# Altium schematic sheet Power Supplies.SchDoc
size A2; SheetNumber: 2; SheetTotal: 16
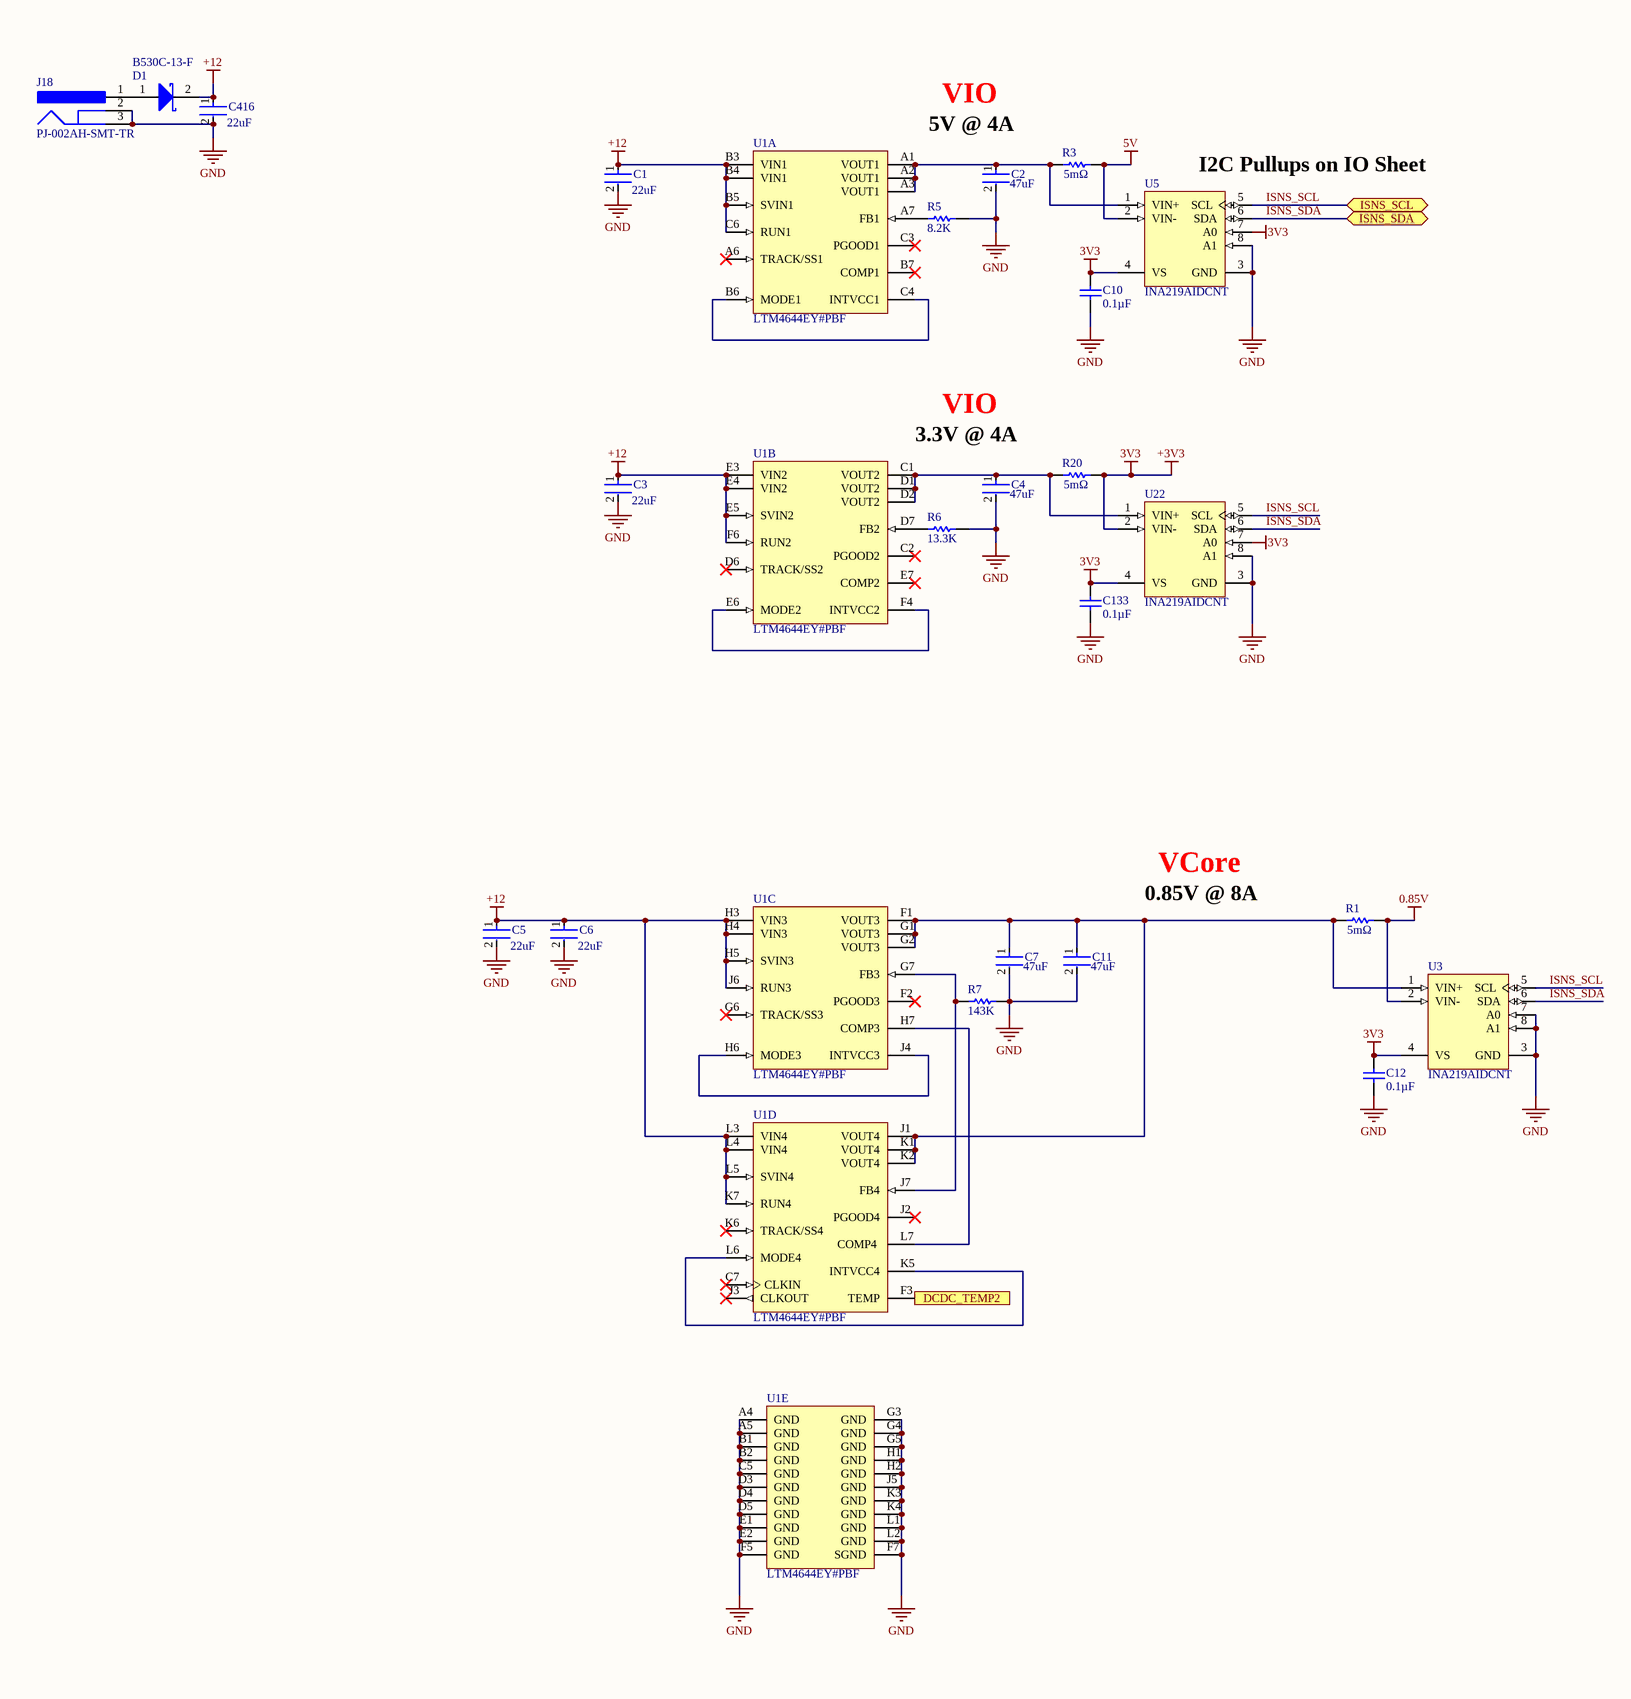
[diagram p0: Power Supplies.SchDoc, left]
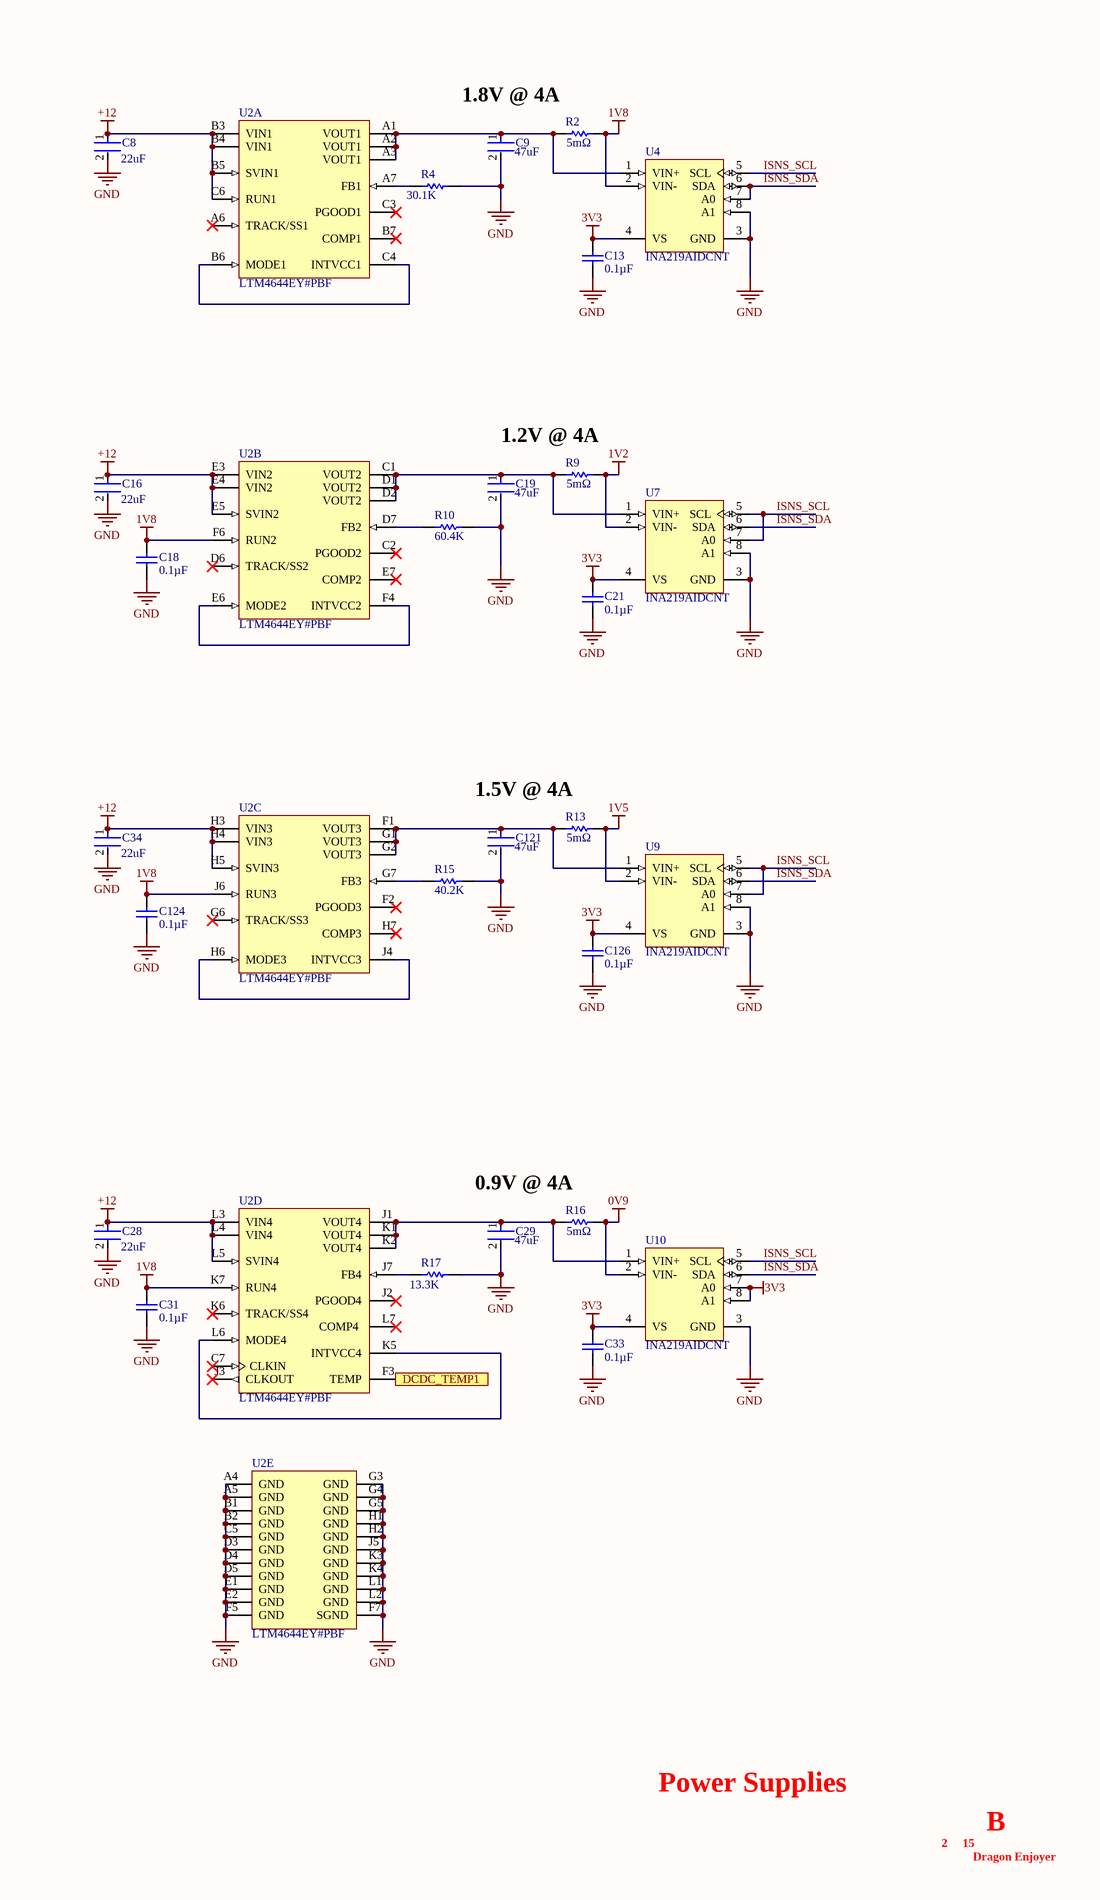
[diagram p1: Power Supplies.SchDoc, right]

## Parts
C1  value 22uF  [FP-CL31H-0_2-MFG]  (hidden comment: CL31A226KAHNNNE)
C2  Capacitance: 47uF  [FP-GRM31C-0_2-e0_3_0_8-IPC_C]  (hidden comment: GRM31CR60J476ME19L)
C3  value 22uF  [FP-CL31H-0_2-MFG]  (hidden comment: CL31A226KAHNNNE)
C4  Capacitance: 47uF  [FP-GRM31C-0_2-e0_3_0_8-IPC_C]  (hidden comment: GRM31CR60J476ME19L)
C5  value 22uF  [FP-CL31H-0_2-MFG]  (hidden comment: CL31A226KAHNNNE)
C6  value 22uF  [FP-CL31H-0_2-MFG]  (hidden comment: CL31A226KAHNNNE)
C7  Capacitance: 47uF  [FP-GRM31C-0_2-e0_3_0_8-IPC_C]  (hidden comment: GRM31CR60J476ME19L)
C8  value 22uF  [FP-CL31H-0_2-MFG]  (hidden comment: CL31A226KAHNNNE)
C9  Capacitance: 47uF  [FP-GRM31C-0_2-e0_3_0_8-IPC_C]  (hidden comment: GRM31CR60J476ME19L)
C10  Capacitance: 0.1µF  [CAPC1005X55X25LL05T05]  (hidden comment: CC0402ZRY5V8BB104)
C11  Capacitance: 47uF  [FP-GRM31C-0_2-e0_3_0_8-IPC_C]  (hidden comment: GRM31CR60J476ME19L)
C12  Capacitance: 0.1µF  [CAPC1005X55X25LL05T05]  (hidden comment: CC0402ZRY5V8BB104)
C13  Capacitance: 0.1µF  [CAPC1005X55X25LL05T05]  (hidden comment: CC0402ZRY5V8BB104)
C16  value 22uF  [FP-CL31H-0_2-MFG]  (hidden comment: CL31A226KAHNNNE)
C18  Capacitance: 0.1µF  [CAPC1005X55X25LL05T05]  (hidden comment: CC0402ZRY5V8BB104)
C19  Capacitance: 47uF  [FP-GRM31C-0_2-e0_3_0_8-IPC_C]  (hidden comment: GRM31CR60J476ME19L)
C21  Capacitance: 0.1µF  [CAPC1005X55X25LL05T05]  (hidden comment: CC0402ZRY5V8BB104)
C28  value 22uF  [FP-CL31H-0_2-MFG]  (hidden comment: CL31A226KAHNNNE)
C29  Capacitance: 47uF  [FP-GRM31C-0_2-e0_3_0_8-IPC_C]  (hidden comment: GRM31CR60J476ME19L)
C31  Capacitance: 0.1µF  [CAPC1005X55X25LL05T05]  (hidden comment: CC0402ZRY5V8BB104)
C33  Capacitance: 0.1µF  [CAPC1005X55X25LL05T05]  (hidden comment: CC0402ZRY5V8BB104)
C34  value 22uF  [FP-CL31H-0_2-MFG]  (hidden comment: CL31A226KAHNNNE)
C121  Capacitance: 47uF  [FP-GRM31C-0_2-e0_3_0_8-IPC_C]  (hidden comment: GRM31CR60J476ME19L)
C124  Capacitance: 0.1µF  [CAPC1005X55X25LL05T05]  (hidden comment: CC0402ZRY5V8BB104)
C126  Capacitance: 0.1µF  [CAPC1005X55X25LL05T05]  (hidden comment: CC0402ZRY5V8BB104)
C133  Capacitance: 0.1µF  [CAPC1005X55X25LL05T05]  (hidden comment: CC0402ZRY5V8BB104)
C416  value 22uF  [FP-CL31H-0_2-MFG]  (hidden comment: CL31A226KAHNNNE)
D1  B530C-13-F  [DIOD-SMC-2_V]
J18  PJ-002AH-SMT-TR  [CUI-PJ-002AH-4_V]
R1  value 5mΩ  [RESC3216X89X64NL25T25]  (hidden comment: WSL12065L000FEA)
R2  value 5mΩ  [RESC3216X89X64NL25T25]  (hidden comment: WSL12065L000FEA)
R3  value 5mΩ  [RESC3216X89X64NL25T25]  (hidden comment: WSL12065L000FEA)
R4  value 30.1K  [RESC1609X55X30ML10T20]  (hidden comment: TNPW060330K1BEEA)
R5  8.2K  [RESC1005X40X25ML05T05]
R6  13.3K  [RESC1005X40X25NL10T10]
R7  143K  [RESC1005X40X25LL05T05]
R9  value 5mΩ  [RESC3216X89X64NL25T25]  (hidden comment: WSL12065L000FEA)
R10  value 60.4K  [RESC1608X50X30ML20T20]  (hidden comment: RG1608P-6042-B-T1)
R13  value 5mΩ  [RESC3216X89X64NL25T25]  (hidden comment: WSL12065L000FEA)
R15  40.2K  [RESC0603(1608)_M]
R16  value 5mΩ  [RESC3216X89X64NL25T25]  (hidden comment: WSL12065L000FEA)
R17  value 13.3K  [RESC1609X55X30ML10T20]  (hidden comment: TNPW060313K3BEEA)
R20  value 5mΩ  [RESC3216X89X64NL25T25]  (hidden comment: WSL12065L000FEA)
U1  LTM4644EY#PBF  [LT-BGA-77-05-08-1900_V]  (parts A,B,C,D,E of 5)
U2  LTM4644EY#PBF  [LT-BGA-77-05-08-1900_V]  (parts A,B,C,D,E of 5)
U3  INA219AIDCNT  [DCN0008A_L]
U4  INA219AIDCNT  [DCN0008A_L]
U5  INA219AIDCNT  [DCN0008A_L]
U7  INA219AIDCNT  [DCN0008A_L]
U9  INA219AIDCNT  [DCN0008A_L]
U10  INA219AIDCNT  [DCN0008A_L]
U22  INA219AIDCNT  [DCN0008A_L]

## Ports
DCDC_TEMP1 (out), DCDC_TEMP2 (out), ISNS_SCL (bidir), ISNS_SDA (bidir)

## Nets
0.85V: R1.2 U3.2(VIN-)
0V9: R16.2 U10.2(VIN-)
1V2: R9.2 U7.2(VIN-)
1V5: R13.2 U9.2(VIN-)
1V8: C18.2 C31.2 C124.2 R2.2 U2.F6(RUN2) U2.J6(RUN3) U2.K7(RUN4) U4.2(VIN-)
5V: R3.2 U5.2(VIN-)
+3V3: C10.2 C12.2 C13.2 C21.2 C33.2 C126.2 C133.2 R20.2 U3.4(VS) U4.4(VS) U5.4(VS) U5.7(A0) U7.4(VS) U9.4(VS) U10.4(VS) U10.7(A0) U10.8(A1) U22.2(VIN-) U22.4(VS) U22.7(A0)  [also labelled 3V3]
+12: C1.1 C3.1 C5.1 C6.1 C8.1 C16.1 C28.1 C34.1 C416.1 D1.2(K) U1.B3(VIN1) U1.B4(VIN1) U1.B5(SVIN1) U1.C6(RUN1) U1.E3(VIN2) U1.E4(VIN2) U1.E5(SVIN2) U1.F6(RUN2) U1.H3(VIN3) U1.H4(VIN3) U1.H5(SVIN3) U1.J6(RUN3) U1.K7(RUN4) U1.L3(VIN4) U1.L4(VIN4) U1.L5(SVIN4) U2.B3(VIN1) U2.B4(VIN1) U2.B5(SVIN1) U2.C6(RUN1) U2.E3(VIN2) U2.E4(VIN2) U2.E5(SVIN2) U2.H3(VIN3) U2.H4(VIN3) U2.H5(SVIN3) U2.L3(VIN4) U2.L4(VIN4) U2.L5(SVIN4)
GND: C1.2 C2.2 C3.2 C4.2 C5.2 C6.2 C7.2 C8.2 C9.2 C10.1 C11.2 C12.1 C13.1 C16.2 C18.1 C19.2 C21.1 C28.2 C29.2 C31.1 C33.1 C34.2 C121.2 C124.1 C126.1 C133.1 C416.2 J18.2 J18.3 R4.2 R5.2 R6.2 R7.2 R10.1 R15.2 R17.2 U1.A4(GND) U1.A5(GND) U1.B1(GND) U1.B2(GND) U1.C5(GND) U1.D3(GND) U1.D4(GND) U1.D5(GND) U1.E1(GND) U1.E2(GND) U1.F5(GND) U1.F7(SGND) U1.G3(GND) U1.G4(GND) U1.G5(GND) U1.H1(GND) U1.H2(GND) U1.J5(GND) U1.K3(GND) U1.K4(GND) U1.L1(GND) U1.L2(GND) U2.A4(GND) U2.A5(GND) U2.B1(GND) U2.B2(GND) U2.C5(GND) U2.D3(GND) U2.D4(GND) U2.D5(GND) U2.E1(GND) U2.E2(GND) U2.F5(GND) U2.F7(SGND) U2.G3(GND) U2.G4(GND) U2.G5(GND) U2.H1(GND) U2.H2(GND) U2.J5(GND) U2.K3(GND) U2.K4(GND) U2.L1(GND) U2.L2(GND) U3.3(GND) U3.7(A0) U3.8(A1) U4.3(GND) U4.8(A1) U5.3(GND) U5.8(A1) U7.3(GND) U7.8(A1) U9.3(GND) U9.8(A1) U10.3(GND) U22.3(GND) U22.8(A1)
DCDC_TEMP1: U2.F3(TEMP) ; port DCDC_TEMP1
DCDC_TEMP2: U1.F3(TEMP) ; port DCDC_TEMP2
ISNS_SCL: U3.5(SCL) U4.5(SCL) U5.5(SCL) U7.5(SCL) U7.7(A0) U9.5(SCL) U9.7(A0) U10.5(SCL) U22.5(SCL) ; port ISNS_SCL
ISNS_SDA: U3.6(SDA) U4.6(SDA) U4.7(A0) U5.6(SDA) U7.6(SDA) U9.6(SDA) U10.6(SDA) U22.6(SDA) ; port ISNS_SDA
NetC2_1: C2.1 R3.1 U1.A1(VOUT1) U1.A2(VOUT1) U1.A3(VOUT1) U5.1(VIN+)
NetC4_1: C4.1 R20.1 U1.C1(VOUT2) U1.D1(VOUT2) U1.D2(VOUT2) U22.1(VIN+)
NetC7_1: C7.1 C11.1 R1.1 U1.F1(VOUT3) U1.G1(VOUT3) U1.G2(VOUT3) U1.J1(VOUT4) U1.K1(VOUT4) U1.K2(VOUT4) U3.1(VIN+)
NetC9_1: C9.1 R2.1 U2.A1(VOUT1) U2.A2(VOUT1) U2.A3(VOUT1) U4.1(VIN+)
NetC19_1: C19.1 R9.1 U2.C1(VOUT2) U2.D1(VOUT2) U2.D2(VOUT2) U7.1(VIN+)
NetC29_1: C29.1 R16.1 U2.J1(VOUT4) U2.K1(VOUT4) U2.K2(VOUT4) U10.1(VIN+)
NetC121_1: C121.1 R13.1 U2.F1(VOUT3) U2.G1(VOUT3) U2.G2(VOUT3) U9.1(VIN+)
NetD1_1: D1.1(A) J18.1
NetR4_1: R4.1 U2.A7(FB1)
NetR5_1: R5.1 U1.A7(FB1)
NetR6_1: R6.1 U1.D7(FB2)
NetR7_1: R7.1 U1.G7(FB3) U1.J7(FB4)
NetR10_2: R10.2 U2.D7(FB2)
NetR15_1: R15.1 U2.G7(FB3)
NetR17_1: R17.1 U2.J7(FB4)
NetU1_B6: U1.B6(MODE1) U1.C4(INTVCC1)
NetU1_E6: U1.E6(MODE2) U1.F4(INTVCC2)
NetU1_H6: U1.H6(MODE3) U1.J4(INTVCC3)
NetU1_H7: U1.H7(COMP3) U1.L7(COMP4)
NetU1_K5: U1.K5(INTVCC4) U1.L6(MODE4)
NetU2_B6: U2.B6(MODE1) U2.C4(INTVCC1)
NetU2_E6: U2.E6(MODE2) U2.F4(INTVCC2)
NetU2_H6: U2.H6(MODE3) U2.J4(INTVCC3)
NetU2_K5: U2.K5(INTVCC4) U2.L6(MODE4)

Not connected (* = marked no-connect by the designer): U1 A6(TRACK/SS1)* B7(COMP1)* C2(PGOOD2)* C3(PGOOD1)* C7(CLKIN)* D6(TRACK/SS2)* E7(COMP2)* F2(PGOOD3)* G6(TRACK/SS3)* J2(PGOOD4)* J3(CLKOUT)* K6(TRACK/SS4)*; U2 A6(TRACK/SS1)* B7(COMP1)* C2(PGOOD2)* C3(PGOOD1)* C7(CLKIN)* D6(TRACK/SS2)* E7(COMP2)* F2(PGOOD3)* G6(TRACK/SS3)* H7(COMP3)* J2(PGOOD4)* J3(CLKOUT)* K6(TRACK/SS4)* L7(COMP4_)*

## Notes on the sheet
- VIO
- 5V @ 4A
- (near U5) I2C Pullups on IO Sheet
- 1.8V @ 4A
- 3.3V @ 4A
- 1.2V @ 4A
- 1.5V @ 4A
- 0.85V @ 8A
- VCore
- 0.9V @ 4A
- Power Supplies
- 2
- 15
- Dragon Enjoyer
- B

## Library data of the parts
C1 C3 C5 C6 C8 C16 C28 C34 C416 = CMP-13271-000012-1: CAP CER 22UF 25V X5R 1206; Manufacturer: Samsung; Temperature Coefficient: 15%; Tolerance: 10%; Material: Ceramic; Automotive: No; Device Class L3: Ceramic Capacitors; Temperature: -55°C to +85°C; Octopart: https://octopart.com/cl31a226kahnnne-samsung-19832795; Temperature Range Low: -55°C; Voltage Rating: 25V; Height: 1.8mm; Temperature Characteristic: X5R; Package: CL31H-0.2; Temperature Range High: +85°C; ComponentLink2URL: http://www.samsungsem.com/kr/support/product-search/mlcc/__icsFiles/afieldfile/2019/05/10/19-CL31A226KAHNNNE.pdf; Ipc Land Pattern Name: CAPC320160X160; Lead Free: Yes; Device Class L2: Capacitors; Device Class L1: Passive Components; Capacitance: 22uF; Digikey Description: CAP CER 22UF 25V X5R 1206; Manufacturer Part Number: CL31A226KAHNNNE; RoHS: TRUE; Category: Cap; ComponentLink2Description: Datasheet
C2 C4 C7 C9 C11 C19 C29 C121 = CMP-2000-06344-2: Chip Multilayer Ceramic Capacitors for General Purpose, 1206, 47uF, X5R, 15%, 20%, 6.3V; Package Quantity: 2000; Mount: Surface Mount; Length: 3.2mm; Thickness: 0.071inch; Lead Free: Lead Free; Tolerance: 20%; Width: 0.063inch; Depth: 1.6mm; Case/Package: 1206; Dielectric: X5R; Radiation Hardening: No; Packaging: Tape and Reel; Voltage Rating (DC): 6.3V; Termination: SMD/SMT; Height: 1.6mm; Max Operating Temperature: 85°C; Case Code (Metric): 3216; Case Code (Imperial): 1206; Voltage: 6.3V; Voltage Rating: 6.3V; Min Operating Temperature: -55°C; Material: Ceramic; REACH SVHC: No SVHC
C10 C12 C13 C18 C21 C31 C33 C124 C126 C133 = CMP-2000-06071-1: Chip Capacitor, 100 nF, -20% to 80%, 25 V, -30 to 85 degC, 0402 (1005 Metric), RoHS, Tape and Reel; Manufacturer: Yageo; Online Catalog: CCSeries; Tolerance: -20%,+80%; Voltage - Rated: 25V; Product Training Modules: MultilayerCeramicCapacitors; Catalog Drawings: CC_0402; Other Names: 311-1375-6; Temperature Coefficient: Y5V(F); Datasheet URL: http://www.farnell.com/datasheets/1132289.pdf; Features: -; Package Description: 2-Pin Surface Mount Device, Body 1 x 0.5 mm; Standard Package: 1; Mounting Technology: SurfaceMount; Lead Style: -; Thickness (Max): 0.022"(0.55mm); Family: CeramicCapacitors; Series: CC; Applications: GeneralPurpose; Lead Spacing: -; Size / Dimension: 0.039"Lx0.020"W(1.00mmx0.50mm); Manufacturer URL: http://www.yageo.com/; Category: Capacitors; Datasheet Version: Rev. 5, 07/2010; Height - Seated (Max): -; Packaging: Digi-Reel®; Operating Temperature: -30°C~85°C; Mounting Type: SurfaceMount,MLCC; Package Reference: 0402; Ratings: -; Package / Case: 0402(1005Metric)
D1 = CMP-1693-00001-3: Surface Mount Schottky Barrier Rectifier, 5 A, 0.55 V, -55 to 150 degC, 2-Pin SMD, RoHS, Tape and Reel; Max Operating Temperature: 125 degC; ComponentLink2Description: Datasheet; PackageDescription: 2-Pin Surface Mount Device, Body 5.905 x 6.855 mm; Radiation Hardening: No; Mount: Surface Mount; Height: 2.3 mm; REACH SVHC: No SVHC; PartNumber: B530C-13-F; Packaging: Tape and Reel; Min Operating Temperature: -55 degC; Mounting Technology: Surface Mount; ComponentLink1URL: http://www.diodes.com/; ComponentLink1Description: Manufacturer URL; DatasheetVersion: Rev. 16-2; Length: 7.11 mm; ComponentLink2URL: http://www.diodes.com/_files/datasheets/ds13012.pdf; Package Quantity: 3000; Width: 6.22 mm; Case/Package: SMC; Pins: 2; RoHSCompliant: True
J18 = CMP-2000-06896-1: DC Power Jack, Right Angle, -25 to 85 degC, 4-Pin 14.8 x 9 x 11 mm SMD, RoHS, Tape and Reel; Manufacturer: CUIInc.; Current Rating: 5A; Voltage Rating: 24V; Outside Contact Diameter: 6.5mm; Inside Contact Diameter: 2mm; Insulation Resistance: 100MOhms; Brand: CUI; Contact Plating: Nickel; Contact Gender: Male; Datasheet URL: http://www.cui.com/product/resource/pj-002ah-smt.pdf; Mounting Style: SMD/SMT; Mounting Technology: SurfaceMount; Operating Temperature Range: -25Cto+85C; Flammability Rating: UL94V-0; Mounting Angle: Right; Packaging: Reel; Connector Type: DCPowerJack; Product Category: DCPowerConnectors; Package Description: 4-Pin Surface Mount Device, Body 14.8 x 9 mm, Pitch 6.1 mm; Factory Pack Quantity: 350; Datasheet Version: Rev. 1.03, 11/2012; Contact Material: Brass; Package Reference: PJ-002AH; Housing Material: Polyamide(PA); PartNumber: PJ-002AH; Manufacturer URL: http://www.cui.com/; Product: Jacks; RoHS: True; Termination Style: SMD/SMT
R1-R3 R9 R13 R16 R20 = CMP-2003-04336-1: Manufacturer: Vishay Dale; Part Number: WSL12065L000FEA
R4 = CMP-2000-03757-1: Manufacturer: Vishay Dale; Part Number: TNPW060330K1BEEA
R5 = CMP-2002-00254-1: Part Number: CRCW04028K20FKED; Manufacturer: Vishay Dale
R6 = CMP-2002-05937-1: Manufacturer: Multicomp; Part Number: MC00625W0402113K3
R7 = CMP-1011-00752-2: Part Number: ERJ-2RKF1433X; Manufacturer: Panasonic
R10 = CMP-2000-02320-1: Manufacturer: Susumu; Part Number: RG1608P-6042-B-T1
R15 = CMP-1012-00691-1: 40K2 0.1W 1% 0603 (1608 Metric)  SMD; Case-Metric: 1608; Value: 40200.00 Ohm; Case-EIA: 0603; Tolerance: 1 %; Technology: SMT; Power: 0.1 W
R17 = CMP-2000-03706-1: Manufacturer: Vishay Dale; Part Number: TNPW060313K3BEEA
U1 U2 = CMP-0492-02658-1: Quad DC/DC uModule Regulator, 4 A, 4 to 14 V, -40 to 125 degC, 77-Pin BGA, RoHS, Tray; Manufacturer: Linear Technology; fOSC: 1 MHz Typ.; IS(VIN): 0.62 A Typ.; VOUT(DC): 1.477 to 1.523 V; VRUN: 1.1 to 1.3 V; VIN: 4 to 14 V; CLKIN: 0.7 V Typ.; IOUT(DC): 0 to 4 A; ComponentLink1URL: http://www.linear.com/; PartNumber: LTM4644EY#PBF; DatasheetVersion: Rev. B; Mounting Technology: Surface Mount; PackageDescription: 77-Pin Ball Grid Array, Body 15 x 9 mm, Pitch 1.27 mm; ComponentLink2Description: Datasheet; ComponentLink1Description: Manufacturer URL; ComponentLink3URL: http://cds.linear.com/docs/en/packaging/05081900_D_bga77.pdf; Packing: Tray; RoHS: TRUE; ComponentLink3Description: Package Specification; PackageVersion: Rev. D; Operating Temperature Range: -40 to 125 degC; ComponentLink2URL: http://cds.linear.com/docs/en/datasheet/4644fb.pdf
U3-U5 U7 U9 U10 U22 = CMP-0704-00039-2: Zero-Drift, Bi-Directional Current / Power Monitor, 3 to 5.5 V, -40 to 125 degC, 8-pin SOT23 (DCN8), Green (RoHS & no Sb/Br); Manufacturer: Texas Instruments; Input Offset (+/-)(Max)(uV): 100; Common Mode Range(Max)(V): 26; Gain(V/V): 1, 0.5, 0.25, 0.125; Vs(Min)(V): 3; Vs(Max)(V): 5.5; Small-Signal Bandwidth(Typ)(MHz): 0.011; Rating: Catalog; SubFamily: Current Shunt Monitor; Common Mode Range(Min)(V): 0; Quiescent Current (+/-)(Typ)(mA): 0.7; Code_JEDEC: MO-178; DatasheetVersion: SBOS448F; ComponentLink3URL: http://www.ti.com/lit/ml/mpds099c/mpds099c.pdf; PackageReference: DCN0008A; Eco-Plan: Green (RoHS & no Sb/Br); PackageVersion: 4202106/D, 11/2009; PackageDescription: 8-Pin Plastic Small Outline, Body 1.6 x 2.9 mm, Pitch 0.65 mm; ComponentLink3Description: Package Specification; ComponentLink1Description: Manufacturer URL; ComponentLink1URL: http://www.ti.com/; CMRR(Min)(dB): 100; Mounting Technology: Surface Mount; ComponentLink2URL: http://www.ti.com/general/docs/lit/getliterature.tsp?genericPartNumber=INA219&fileType=pdf; PartNumber: INA219AIDCNT; ComponentLink2Description: Datasheet